# EAGLE design breakout (EAGLE 5.04)
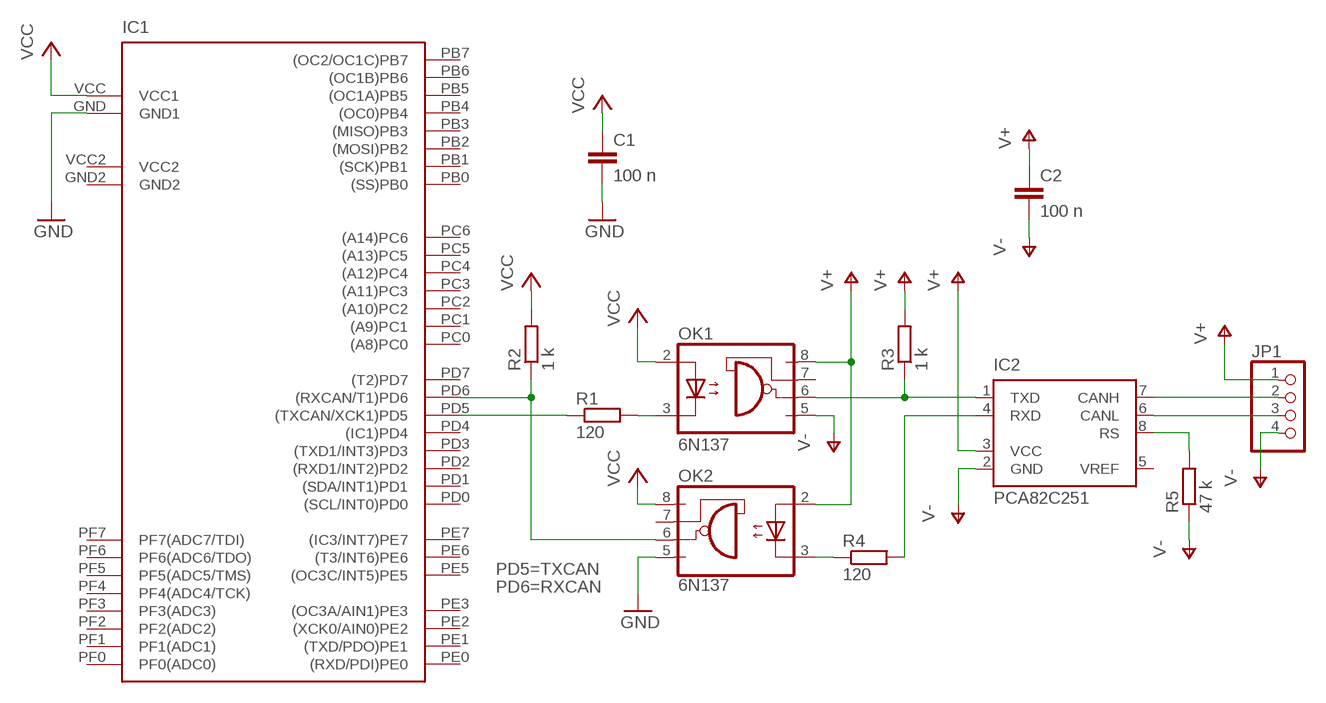
[diagram p0: schematic, sheet 1]

## Parts
C1  100 n  C-EU025-025X050  [C025-025X050]
C2  100 n  C-EU025-025X050  [C025-025X050]
IC1  MEGA128  [OCTOPUS]
IC2  PCA82C251  [SO-08]
JP1  PINHD-1X4  [1X04]
OK1  6N137  [DIL08]
OK2  6N137  [DIL08]
R1  120  R-EU_0207/10  [0207/10]
R2  1 k  R-EU_0207/10  [0207/10]
R3  1 k  R-EU_0207/10  [0207/10]
R4  120  R-EU_0207/10  [0207/10]
R5  47 k  R-EU_0207/10  [0207/10]

## Nets
GND: C1.2 IC1.GND(GND1) OK2.5(GND)
N$1: IC2.1(TXD) OK1.6(VO) R3.1
N$2: OK1.3(C) R1.2
N$3: IC1.PD5((TXCAN/XCK1)PD5) R1.1
N$4: IC1.PD6((RXCAN/T1)PD6) OK2.6(VO) R2.1
N$5: IC2.4(RXD) R4.2
N$6: OK2.3(C) R4.1
N$8: IC2.8(RS) R5.2
N$10: IC2.7(CANH) JP1.2
N$11: IC2.6(CANL) JP1.3
V+: C2.1 IC2.3(VCC) JP1.1 OK1.8(VCC) OK2.2(A) R3.2
V-: C2.2 IC2.2(GND) JP1.4 OK1.5(GND) R5.1
VCC: C1.1 IC1.VCC(VCC1) OK1.2(A) OK2.8(VCC) R2.2
Unconnected: IC1.GND2 IC1.PB0((SS)PB0) IC1.PB1((SCK)PB1) IC1.PB2((MOSI)PB2) IC1.PB3((MISO)PB3) IC1.PB4((OC0)PB4) IC1.PB5((OC1A)PB5) IC1.PB6((OC1B)PB6) IC1.PB7((OC2/OC1C)PB7) IC1.PC0((A8)PC0) IC1.PC1((A9)PC1) IC1.PC2((A10)PC2) IC1.PC3((A11)PC3) IC1.PC4((A12)PC4) IC1.PC5((A13)PC5) IC1.PC6((A14)PC6) IC1.PD0((SCL/INT0)PD0) IC1.PD1((SDA/INT1)PD1) IC1.PD2((RXD1/INT2)PD2) IC1.PD3((TXD1/INT3)PD3) IC1.PD4((IC1)PD4) IC1.PD7((T2)PD7) IC1.PE0((RXD/PDI)PE0) IC1.PE1((TXD/PDO)PE1) IC1.PE2((XCK0/AIN0)PE2) IC1.PE3((OC3A/AIN1)PE3) IC1.PE5((OC3C/INT5)PE5) IC1.PE6((T3/INT6)PE6) IC1.PE7((IC3/INT7)PE7) IC1.PF0(PF0(ADC0)) IC1.PF1(PF1(ADC1)) IC1.PF2(PF2(ADC2)) IC1.PF3(PF3(ADC3)) IC1.PF4(PF4(ADC4/TCK)) IC1.PF5(PF5(ADC5/TMS)) IC1.PF6(PF6(ADC6/TDO)) IC1.PF7(PF7(ADC7/TDI)) IC1.VCC2 IC2.5(VREF) OK1.7(VE) OK2.7(VE)

## Notes on the sheet
- PD5=TXCAN
- PD6=RXCAN

## Library data of the parts
C1 C2 = rcl:C-EU: CAPACITOR, European symbol
IC1 = breakout:MEGA128: Octopus USB multi-I/O board http://www.embedded-projects.net/octopus
IC2 = breakout:PCA82C251: PCA82C251 CAN coupler
JP1 = pinhead:PINHD-1X4: PIN HEADER
OK1 OK2 = optocoupler:6N137: MOTOROLA OPTO COUPLER
R1-R5 = rcl:R-EU_: RESISTOR, European symbol

## Board
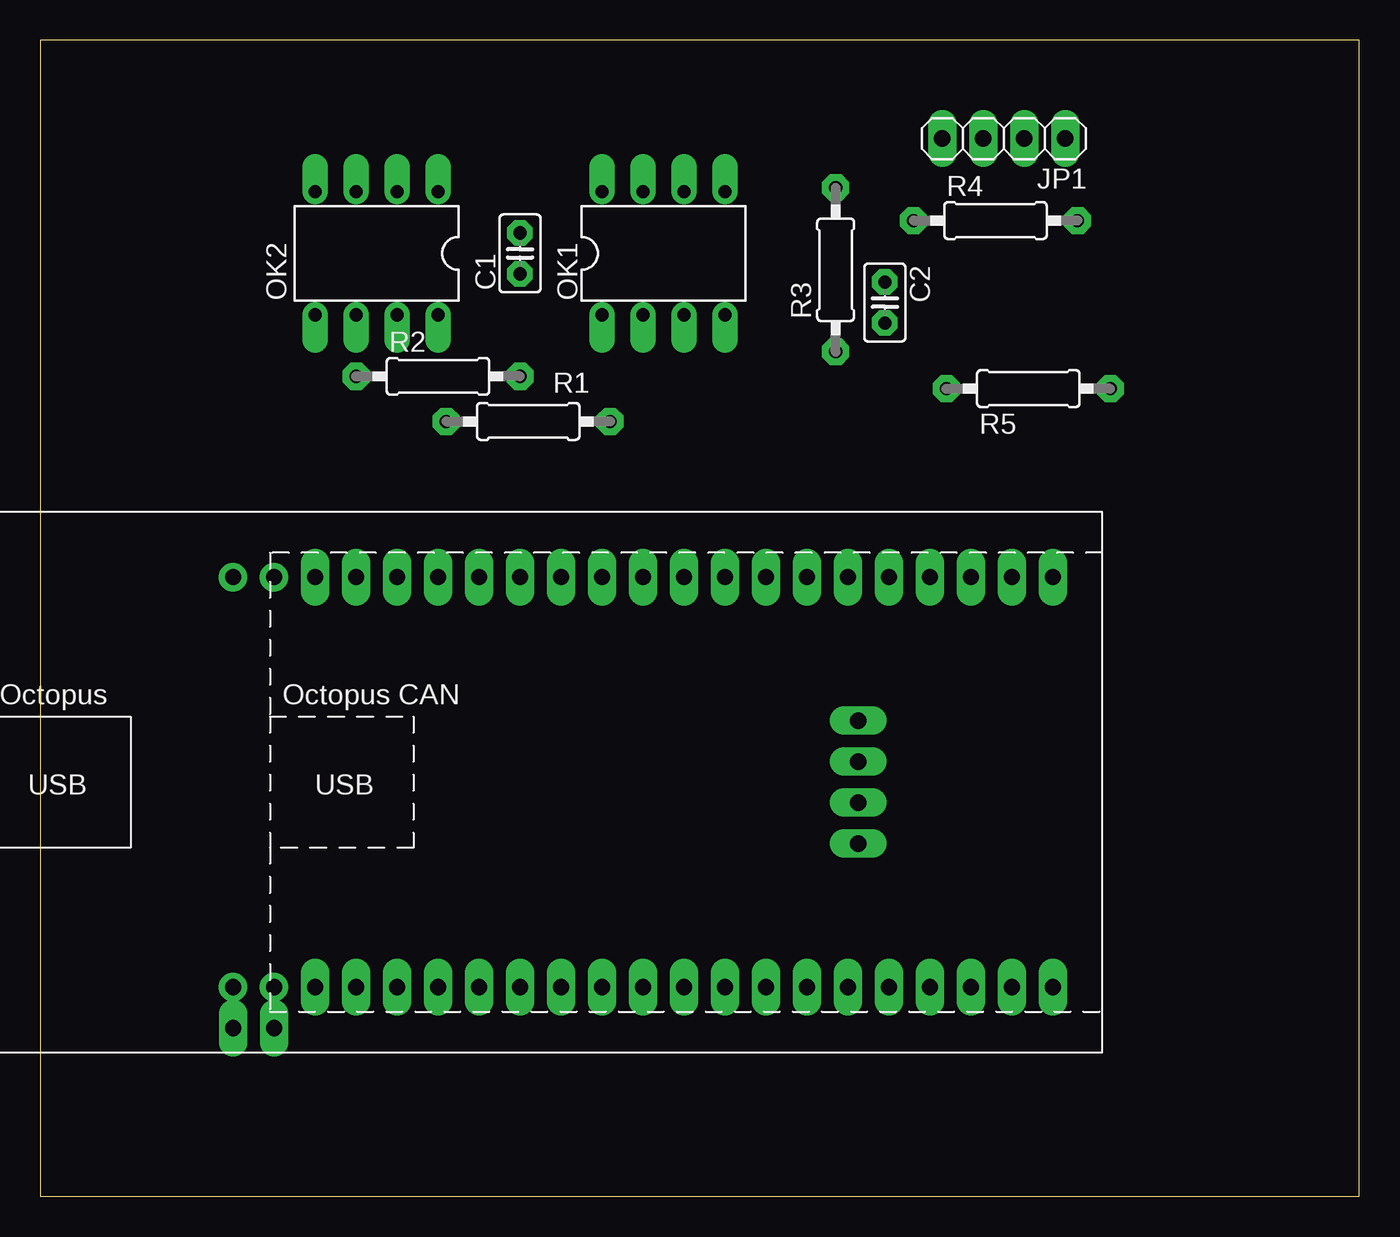
[diagram p1: board, top side]
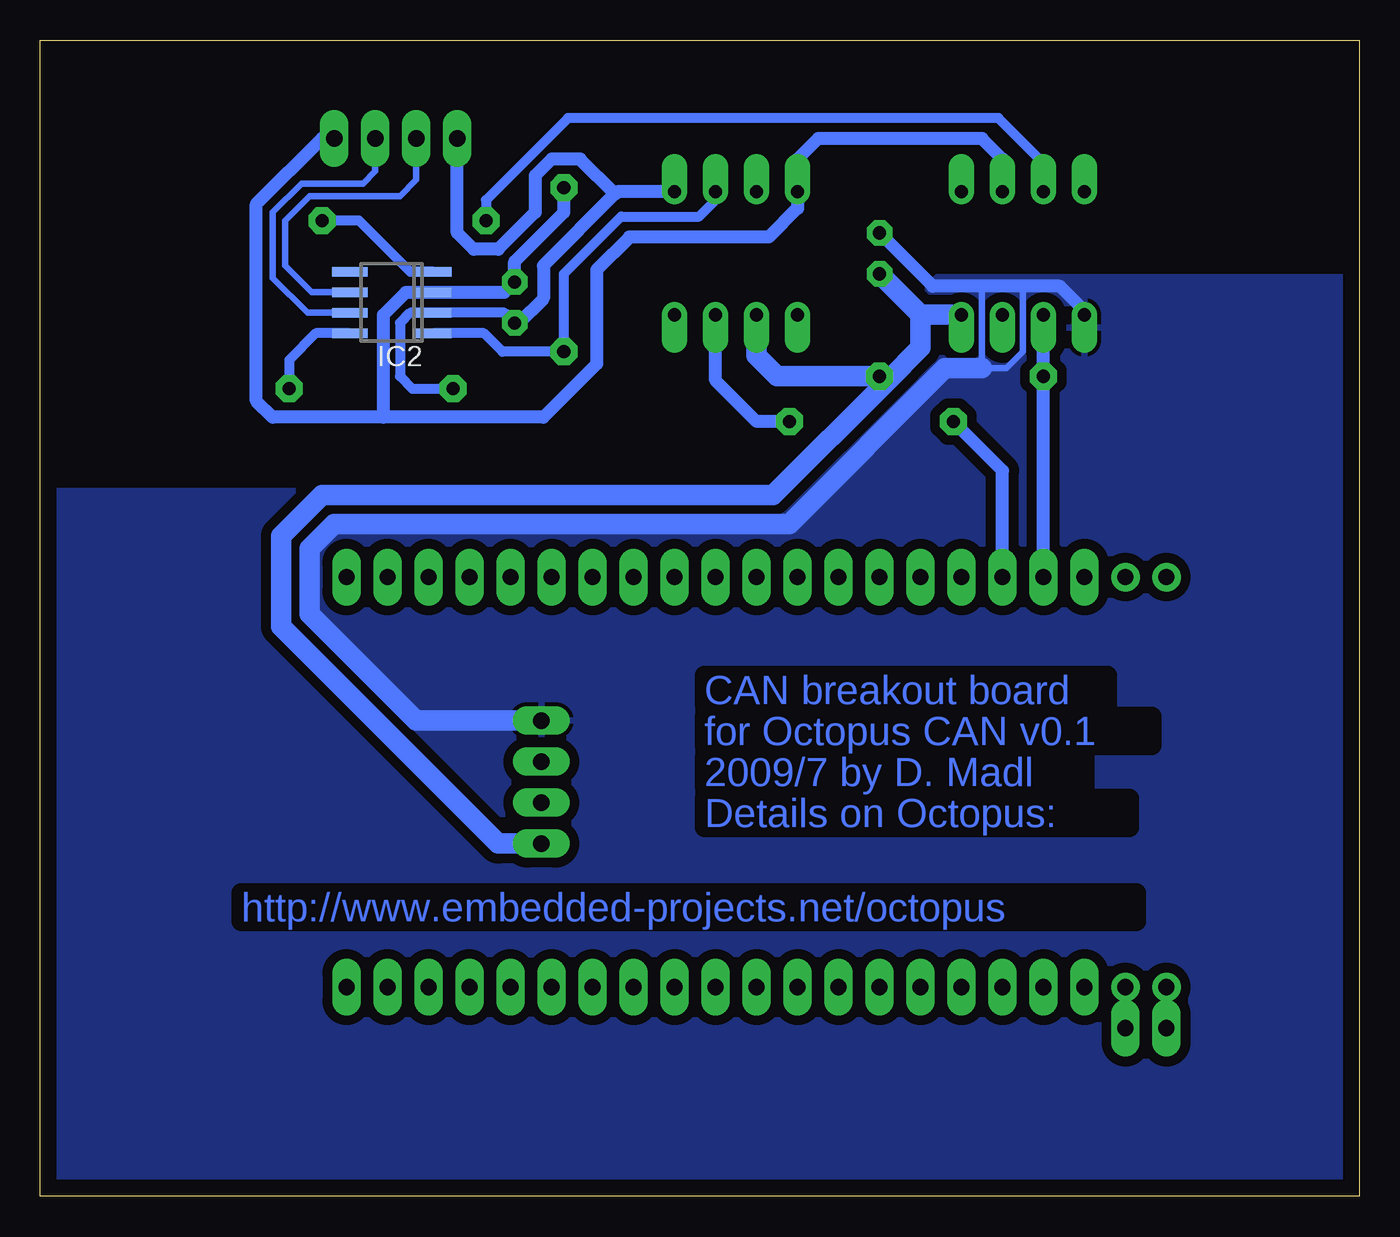
[diagram p2: board, bottom side, seen from below]

Size 81.71 x 71.62 mm. Coordinates in mm from the lower left corner, seen from the top.
Outline: 0,0 81.71,0 81.71,71.62 0,71.62 0,0
Copper layers (1*16): Top 0.035mm / dielectric 1.5mm / Bottom 0.035mm
Design rules "default *": minimum track width 10mil, minimum drill 24mil, track to track 8mil, track to pad 8mil, pad to pad 8mil, via to via 8mil, smd to smd 8mil, copper to edge 40mil, drill to drill 8mil, minimum pad ring 15mil, minimum via ring 8mil, stop-mask expansion 4mil, vias tented up to drill 0mil, thermal gap 10mil

### Footprints (pad centres in the part's own frame; a part is rotated, then mirrored left to right if it is on the bottom)
C025-025X050 = drill 0.813 octagon: 1 -1.27,0; 2 1.27,0
OCTOPUS = drill 1 long: GND 19.685,3.81; GND2 -16.51,-15.24; PB0 24.13,12.7; PB1 21.59,12.7; PB2 19.05,12.7; PB3 16.51,12.7; PB4 13.97,12.7; PB5 11.43,12.7; PB6 8.89,12.7; PB7 6.35,12.7; PC0 -13.97,-12.7; PC1 -11.43,-12.7; PC2 -8.89,-12.7; PC3 -6.35,-12.7; PC4 -3.81,-12.7; PC5 -1.27,-12.7; PC6 1.27,-12.7; PD0 3.81,12.7; PD1 1.27,12.7; PD2 -1.27,12.7; PD3 -3.81,12.7; PD4 -6.35,12.7; PD5 -8.89,12.7; PD6 -11.43,12.7; PD7 -13.97,12.7; PE0 24.13,-12.7; PE1 26.67,-12.7; PE2 29.21,-12.7; PE3 31.75,-12.7; PE5 31.75,12.7; PE6 29.21,12.7; PE7 26.67,12.7; PF0 21.59,-12.7; PF1 19.05,-12.7; PF2 16.51,-12.7; PF3 13.97,-12.7; PF4 11.43,-12.7; PF5 8.89,-12.7; PF6 6.35,-12.7; PF7 3.81,-12.7; RX0 19.685,-1.27; TX0 19.685,1.27; VCC 19.685,-3.81; VCC2 -19.05,-15.24 | drill 1 round: NC1 -16.51,12.7; NC2 -19.05,12.7; NC3 -16.51,-12.7; NC4 -19.05,-12.7
SO-08 = smd 0.6 x 2.2: 1 -1.905,-2.6; 2 -0.635,-2.6; 3 0.635,-2.6; 4 1.905,-2.6; 5 1.905,2.6; 6 0.635,2.6; 7 -0.635,2.6; 8 -1.905,2.6
1X04 = drill 1.016 long: 1 -3.81,0; 2 -1.27,0; 3 1.27,0; 4 3.81,0
DIL08 = drill 0.813 offset: 1 -3.81,-3.81; 2 -1.27,-3.81; 3 1.27,-3.81; 4 3.81,-3.81; 5 3.81,3.81; 6 1.27,3.81; 7 -1.27,3.81; 8 -3.81,3.81
0207/10 = drill 0.813 pad 1.676 octagon: 1 -5.08,0; 2 5.08,0

### Placement (x,y rotation side)
C1  29.72,58.42 90 top
C2  52.32,55.37 270 top
IC1  30.99,25.65 0 top
IC2  59.94,55.37 90 bottom
JP1  59.69,65.53 180 top
OK1  38.61,58.42 0 top
OK2  20.83,58.42 180 top
R1  30.23,48.01 0 top
R2  24.64,50.8 0 top
R3  49.28,57.4 90 top
R4  59.18,60.45 0 top
R5  61.21,50.04 0 top

### Tracks (layer width: path | path; a pad name or v marks a point on that pad's centre or on a via)
GND
  Bottom 0.406: 23.37,56.39 23.37,51.31 21.84,51.31 20.83,52.32 20.83,56.39
  Bottom 0.813: OK2.5 17.02,54.86 18.54,56.39 20.83,56.39 23.37,56.39 26.42,56.39 C1.2
  Bottom 1.27: IC1.GND 58.42,29.46 65.02,36.07 65.02,40.13 63.5,41.66 35.31,41.66 25.65,51.31 23.37,51.31
  pour Bottom (isolate 0.61): -0.06,0 81.72,0 81.72,43.69 37.15,43.69 28.38,52.45 28.38,54.74 26.16,56.96 -0.06,56.96
N$1
  Bottom 0.61: IC2.1 54.23,53.47 53.09,52.32 R3.1 49.28,57.15 45.72,60.71 40.89,60.71 39.88,61.72 OK1.6
N$2
  Bottom 0.813: R1.2 37.34,48.01 39.88,50.55 OK1.3
N$3
  Bottom 0.813: IC1.PD5 22.1,44.96 R1.1
N$4
  Bottom 0.813: OK2.6 R2.1 IC1.PD6
N$5
  Bottom 0.61: IC2.4 58.8,57.28 61.98,60.45 R4.2
N$6
  Bottom 0.61: R4.1 54.1,61.72 49.02,66.8 22.35,66.8 19.56,64.01 OK2.3
N$8
  Bottom 0.61: IC2.8 64.64,53.47 66.29,51.82 R5.2
N$10
  Bottom 0.406: JP1.2 60.96,63.5 61.72,62.74 65.53,62.74 67.31,60.96 67.31,56.9 65.15,54.74 IC2.7
N$11
  Bottom 0.406: JP1.3 58.42,62.99 59.44,61.98 65.02,61.98 66.55,60.45 66.55,57.66 64.9,56.01 IC2.6
V+
  Bottom 0.813: OK2.2 22.1,64.26 23.37,65.53 33.53,65.53 34.8,64.26 OK1.8 34.8,61.21 36.58,59.44 45.21,59.44 47.24,57.4 47.24,51.56 50.55,48.26 60.45,48.26 | R3.2 49.28,60.96 52.32,57.91 C2.1 52.96,56.01 IC2.3 59.05,56.01 60.45,54.61 60.45,48.26 | JP1.1 64.26,65.53 68.33,61.47 68.33,49.28 67.31,48.26 60.45,48.26
V-
  Bottom 0.61: C2.2 52.96,54.74 IC2.2 58.8,54.74 59.44,54.1 59.44,50.8 58.67,50.04 R5.1
  Bottom 0.813: OK1.5 45.97,62.23 46.1,62.1 | 46.1,62.1 50.55,57.66 50.55,55.63 52.07,54.1 C2.2 | JP1.4 55.88,59.69 54.86,58.67 53.34,58.67 51.05,60.96 51.05,63.25 50.04,64.26 48.26,64.26 46.1,62.1
VCC
  Bottom 1.27: 29.21,50.55 27.18,52.58 27.18,54.61 | 27.18,54.61 C1.1 | 27.18,54.61 OK2.8 | IC1.VCC 53.34,21.84 66.8,35.31 66.8,40.89 64.26,43.43 36.32,43.43 29.21,50.55 | 29.21,50.55 R2.2 36.07,50.8 37.34,52.07 OK1.2

### Text on the board
Bottom: CAN breakout board | for Octopus CAN v0.1 | 2009/7 by D. Madl | Details on Octopus: | http://www.embedded-projects.net/octopus